# Altium schematic sheet GP_ESP32_Circuit_Sheet.SchDoc
size B; SheetNumber: 3; SheetTotal: 3
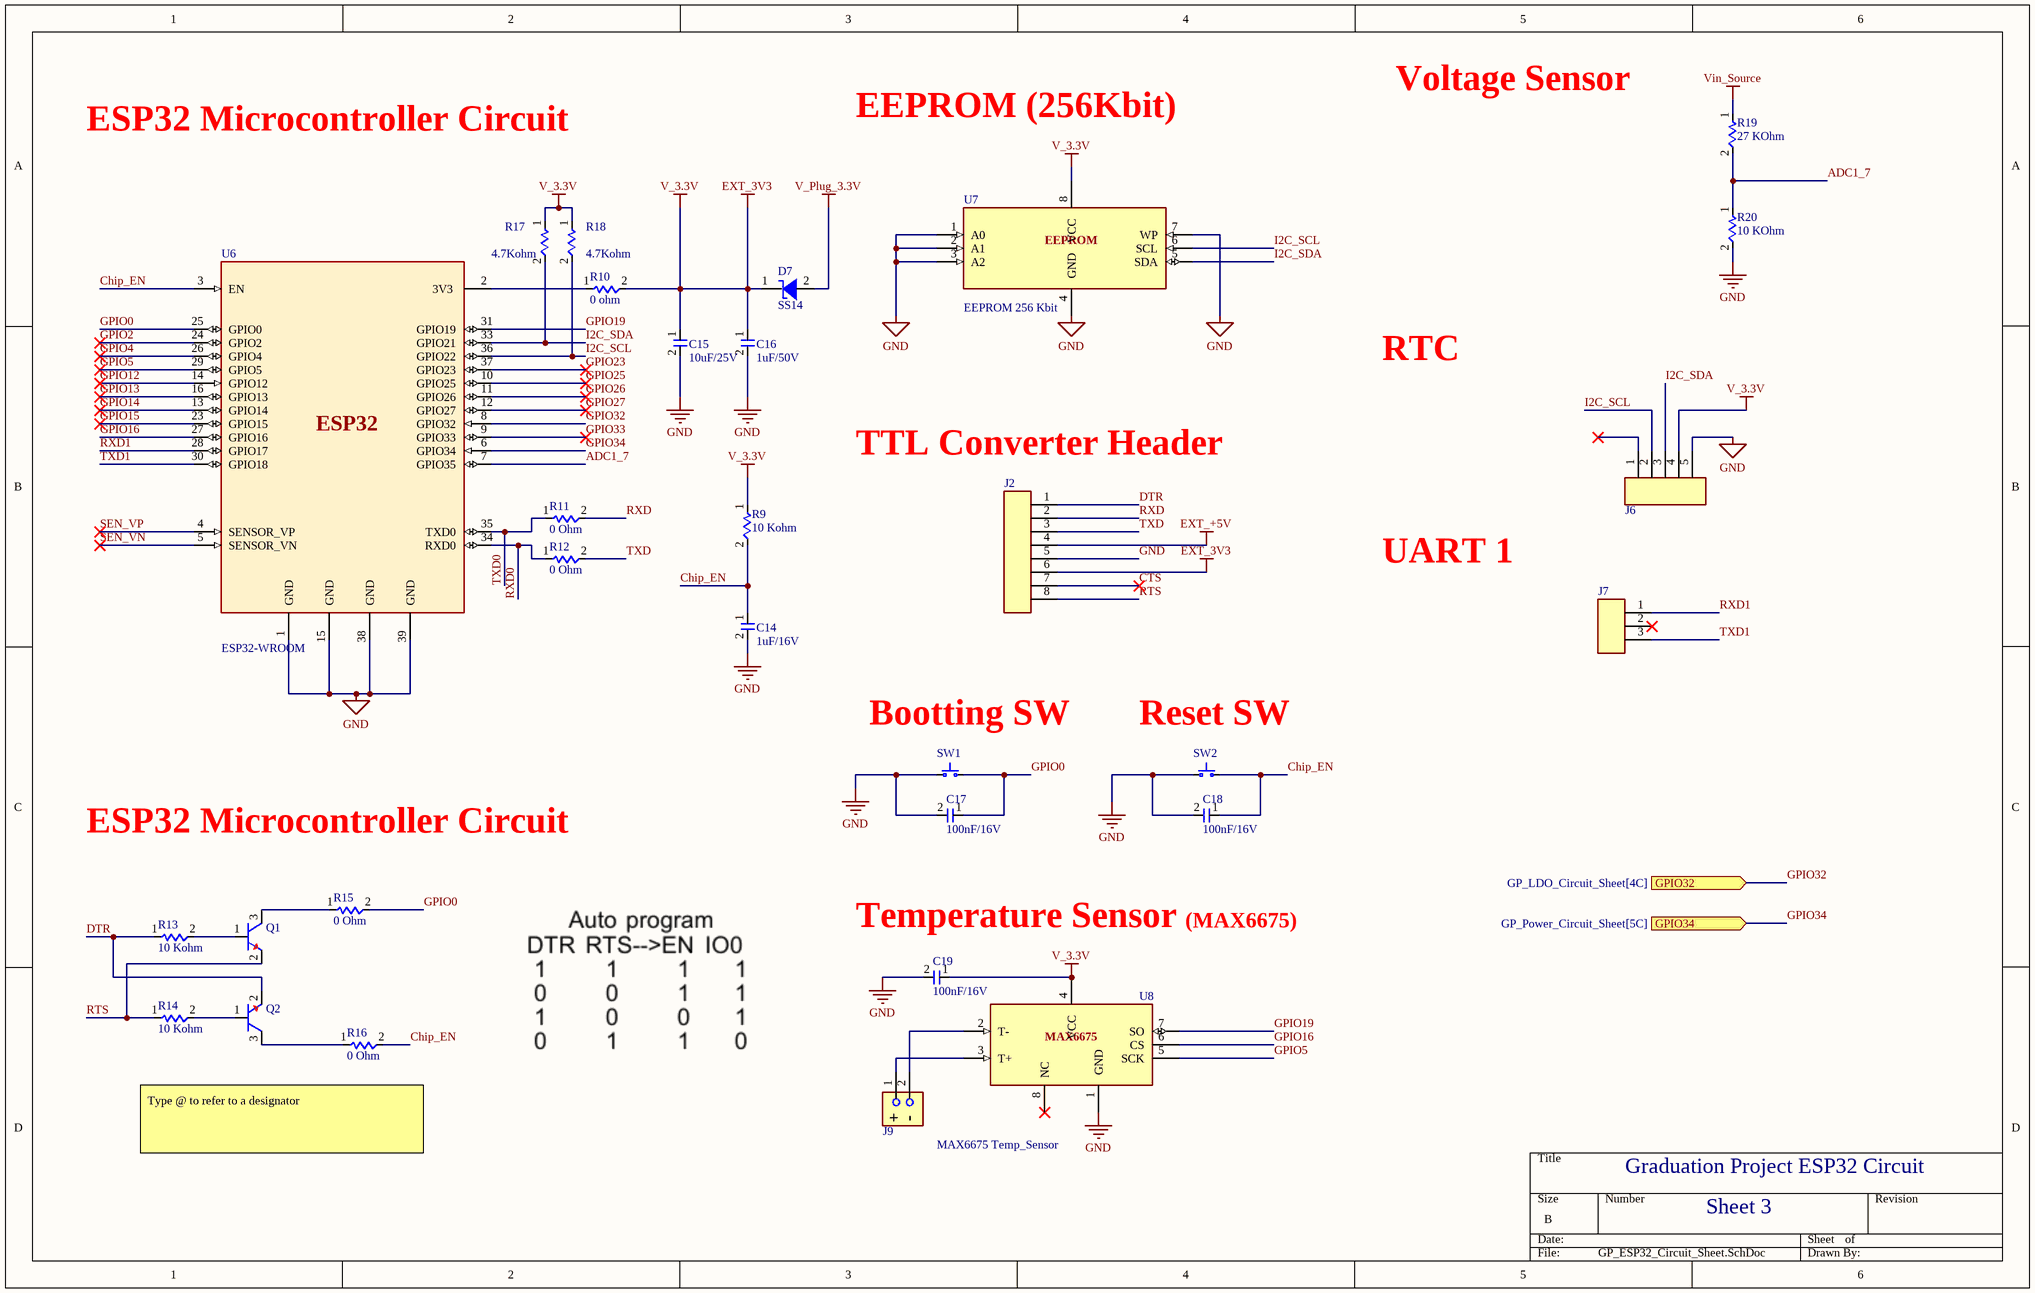
[diagram p0: GP_ESP32_Circuit_Sheet.SchDoc]

## Parts
C14  1uF/16V  [Capacitor 100nF]
C15  10uF/25V  [Capacitor 100nF]
C16  1uF/50V  [Capacitor 100nF]
C17  100nF/16V  [Capacitor 100nF]
C18  100nF/16V  [Capacitor 100nF]
C19  100nF/16V  [Capacitor 100nF]
D7  SS14  [Schottky SS14]
J2  Pin Header 1x8  [Pin Header 1x8]  (value not drawn)
J6  Pin Header 1x5  [Header Pin 1x5]  (value not drawn)
J7  Pin Header 1x2  [Header Pin 1x3]  (value not drawn)
J9  terminal block connector  [Battery Connector]  (value not drawn)
Q1  Transistor npn  [Transistor npn]  (value not drawn)
Q2  Transistor npn  [Transistor npn]  (value not drawn)
R9  10 Kohm  [Resistor 4.7KKohm]
R10  0 ohm  [Resistor 4.7KKohm]
R11  0 Ohm  [Resistor 0.050ohm]
R12  0 Ohm  [Resistor 0.050ohm]
R13  10 Kohm  [Resistor 4.7KKohm]
R14  10 Kohm  [Resistor 4.7KKohm]
R15  0 Ohm  [Resistor 0.050ohm]
R16  0 Ohm  [Resistor 0.050ohm]
R17  4.7Kohm  [Resistor 4.7KKohm]
R18  4.7Kohm  [Resistor 4.7KKohm]
R19  27 KOhm  [Resistor 0.050ohm]
R20  10 KOhm  [Resistor 0.050ohm]
SW1  Push Button  [Push Button]  (value not drawn)
SW2  Push Button  [Push Button]  (value not drawn)
U6  ESP32-WROOM  [ESP32]
U7  EEPROM 256 Kbit  [EEPROM]
U8  MAX6675 Temp_Sensor  [MAX6675]

## Ports
GPIO32 (in, see GP_LDO_Circuit_Sheet[4C]), GPIO34 (in, see GP_Power_Circuit_Sheet[5C])

## Nets
EXT_3V3: C15.1(Pin_1) C16.1(Pin_1) C19.1(Pin_1) D7.1 J2.6 J6.4 R9.1(Pin_1) R10.2(pin_2) R17.1(Pin_1) R18.1(Pin_1) U7.8(VCC) U8.4(VCC)  [also labelled V_3.3V]
EXT_+5V: J2.4
GND: C14.2(Pin_2) C15.2(Pin_2) C16.2(Pin_2) C17.2(Pin_2) C18.2(Pin_2) C19.2(Pin_2) J2.5 J6.5 R20.2(pin_2) SW1.1 SW2.1 U6.1(GND) U6.15(GND) U6.38(GND) U6.39(GND) U7.1(A0) U7.2(A1) U7.3(A2) U7.4(GND) U7.7(WP) U8.1(GND)
V_Plug_3.3V: D7.2
Vin_Source: R19.1(Pin_1)
ADC1_7: R19.2(pin_2) R20.1(Pin_1) U6.7(GPIO35)
Chip_EN: C14.1(Pin_1) C18.1(Pin_1) R9.2(pin_2) R16.2(pin_2) SW2.2 U6.3(EN)
CTS: J2.7
DTR: J2.1 Q2.2 R13.1(Pin_1)
GPIO0: C17.1(Pin_1) R15.2(pin_2) SW1.2 U6.25(GPIO0)
GPIO2: U6.24(GPIO2)
GPIO4: U6.26(GPIO4)
GPIO5: U6.29(GPIO5) U8.5(SCK)
GPIO12: U6.14(GPIO12)
GPIO13: U6.16(GPIO13)
GPIO14: U6.13(GPIO14)
GPIO15: U6.23(GPIO15)
GPIO16: U6.27(GPIO16) U8.6(CS)
GPIO19: U6.31(GPIO19) U8.7(SO)
GPIO23: U6.37(GPIO23)
GPIO25: U6.10(GPIO25)
GPIO26: U6.11(GPIO26)
GPIO27: U6.12(GPIO27)
GPIO32: U6.8(GPIO32) ; port GPIO32
GPIO33: U6.9(GPIO33)
GPIO34: U6.6(GPIO34) ; port GPIO34
I2C_SCL: J6.2 R18.2(pin_2) U6.36(GPIO22) U7.6(SCL)
I2C_SDA: J6.3 R17.2(pin_2) U6.33(GPIO21) U7.5(SDA)
RTS: J2.8 Q1.2 R14.1(Pin_1)
RXD: J2.2 R11.2(pin_2)
RXD0: R12.1(Pin_1) U6.34(RXD0)
RXD1: J7.1 U6.28(GPIO17)
SEN_VN: U6.5(SENSOR_VN)
SEN_VP: U6.4(SENSOR_VP)
TXD: J2.3 R12.2(pin_2)
TXD0: R11.1(Pin_1) U6.35(TXD0)
TXD1: J7.3 U6.30(GPIO18)
NetJ9_1: J9.1 U8.3(T+)
NetJ9_2: J9.2 U8.2(T-)
NetQ1_1: Q1.1 R13.2(pin_2)
NetQ1_3: Q1.3 R15.1(Pin_1)
NetQ2_1: Q2.1 R14.2(pin_2)
NetQ2_3: Q2.3 R16.1(Pin_1)
NetR10_1: R10.1(Pin_1) U6.2(3V3)

Not connected (* = marked no-connect by the designer): J6 1*; J7 2*; U8 8(NC)*

## Notes on the sheet
- Voltage Sensor
- ESP32 Microcontroller Circuit
- EEPROM (256Kbit)
- RTC
- (near J2) TTL Converter Header
- UART 1
- (near SW1) Bootting SW
- (near SW2) Reset SW
- (near C19) Temperature Sensor
- (MAX6675)
- Type @ to refer to a designator
- Graduation Project ESP32 Circuit
- Sheet 3
- (in symbol EEPROM 256 Kbit) EEPROM
- (in symbol ESP32-WROOM) ESP32
- (in symbol MAX6675 Temp_Sensor) MAX6675
- (in symbol Terminal Block) -; +

## Library data of the parts
C14-C19 = Capacitor 100nF: Ceramic Capacitor (100nF , 50V) SMD (1206); Parameter 1: *; ComponentLink1Description: Link; ComponentLink1URL: https://free-electronic.com/product/ceramic-capacitor-100nf-50v-smd-1206/
D7 = Schottky SS14: SMD Schottky diode 5A 40V 1N5824 SS54 DO-214AB SMC; ComponentLink1Description: Part Number; ComponentLink1URL: 1N5824 SS54; ComponentLink2Description: Market Link; ComponentLink2URL: https://uge-one.com/product/smd-schottky-diode-5a-40v-1n5824-ss54-do-214ab-smc/
J2 = Pin Header 1x8: Pin Header male (2.54mm) 1X40 Straight Long (20 CM)
J6 = Pin Header 1x5: Pin Header male (2.54mm) 1X40 Straight Long (20 CM)
J7 = Pin Header 1x2: Pin Header male (2.54mm) 1X40 Straight Long (20 CM)
J9 = Terminal Block: 2-Pole 5mm Pitch PCB Mount Screw TermInal Block 8A 250V; ComponentLink1Description: Part Number; ComponentLink1URL: KF126-5.0-2P; ComponentLink2Description: Market link; ComponentLink2URL: https://free-electronic.com/product/terminal-block-2-pin-kf126-5-0-2p/
Q1 Q2 = Transistor npn: 0.6A , 75V , NPN General Purpose Transistor .(SOT-23); ComponentLink1Description: Market Link; ComponentLink1URL: https://free-electronic.com/product/mmbt2222a-smd-1p/; ComponentLink2Description: Part Number; ComponentLink2URL: MMBT2222A
  Q1: ComponentLink3Description: New link; ComponentLink3URL: *
R9 R13 R14 = Resistor 10 Kohm: SMD RESISTORS 200V-500V 1206 ? 5% tolerance; ComponentLink1Description: Part Number; ComponentLink1URL: A1-20-1206-4.7K; ComponentLink2Description: Market Link; ComponentLink2URL: https://free-electronic.com/?s=Resistor+SMD+10+Kohm&product_cat=0&post_type=product
R10 R17 R18 = Resistor 4.7Kohm: SMD Resistor (220 ohm , 1/4W); ComponentLink1Description: Part Number; ComponentLink1URL: A1-20-1206-4.7K; ComponentLink2Description: Market Link; ComponentLink2URL: https://free-electronic.com/product/smd-resistor-4-7-kohm-1-4w/
R11 R12 R15 R16 R19 R20 = Resistor 0.050 Ohm: 2512 SMD Alloy Power Shunt Resistors 1W 6.4×3.2mm 0.050 Ohm ( SMD Marking R050); ComponentLink1Description: Market Link; ComponentLink1URL: https://uge-one.com/product/2512-smd-alloy-power-shunt-resistors-1w-6-4x3-2mm-0-050-ohm-smd-marking-r050/
SW1 SW2 = Push Button: PCB Press 2pin (6X6) 100K cycles / Momentary Push Button Tact Tactile Switch; ComponentLink1Description: Market Link; ComponentLink1URL: https://free-electronic.com/product/press-2pin-6x6/
U6 = ESP32-WROOM: Bluetooth, WiFi 802.11b/g/n, Bluetooth v5.0 Transceiver Module 2.4GHz PCB Trace Surface Mount; ComponentLink1Description: Product Number; ComponentLink1URL: D25-7-ESP32-WROOM; ComponentLink2Description: Market Link; ComponentLink2URL: https://uge-one.com/product/esp32-wroom-32-wifi-ble-smd-module/
U7 = EEPROM 256 Kbit: I2C-Compatible, (2-Wire) Serial EEPROM 256-Kbit (32,768 x 8).(SOIC-8); ComponentLink1Description: Market Link; ComponentLink1URL: https://free-electronic.com/product/atmlh945-24c256-smd/
U8 = MAX6675 Temp_Sensor: Cold-Junction-Compensated K-Thermocoupleto-Digital Converter (0?C to +1024?C).(SO-8); ComponentLink1Description: Market Link; ComponentLink1URL: https://free-electronic.com/product/max6675isa-smd/